# Altium schematic sheet Power_Management.SchDoc: AMC FMC Carrier v4.0.5
size 420 x 297 mm; CompanyName: WUT; Organization: WUT ISE; Address1: Warsaw University of Technology; Address2: Nowowiejska 15/19 00-665 Warsaw; Address3: t.przywozki@gmail.com; Revision: 1; SheetNumber: 10; SheetTotal: 29; Project: AMC FMC Carrier v4.0.5; ModifiedBy: F. Świtakowski; CheckedDate: -; Title2: Power entry & management; DivGrp: ISE; Designer: T. Przywozki; ModifiedDate: -; ProjectName: ADC/DAC MEZZANINE
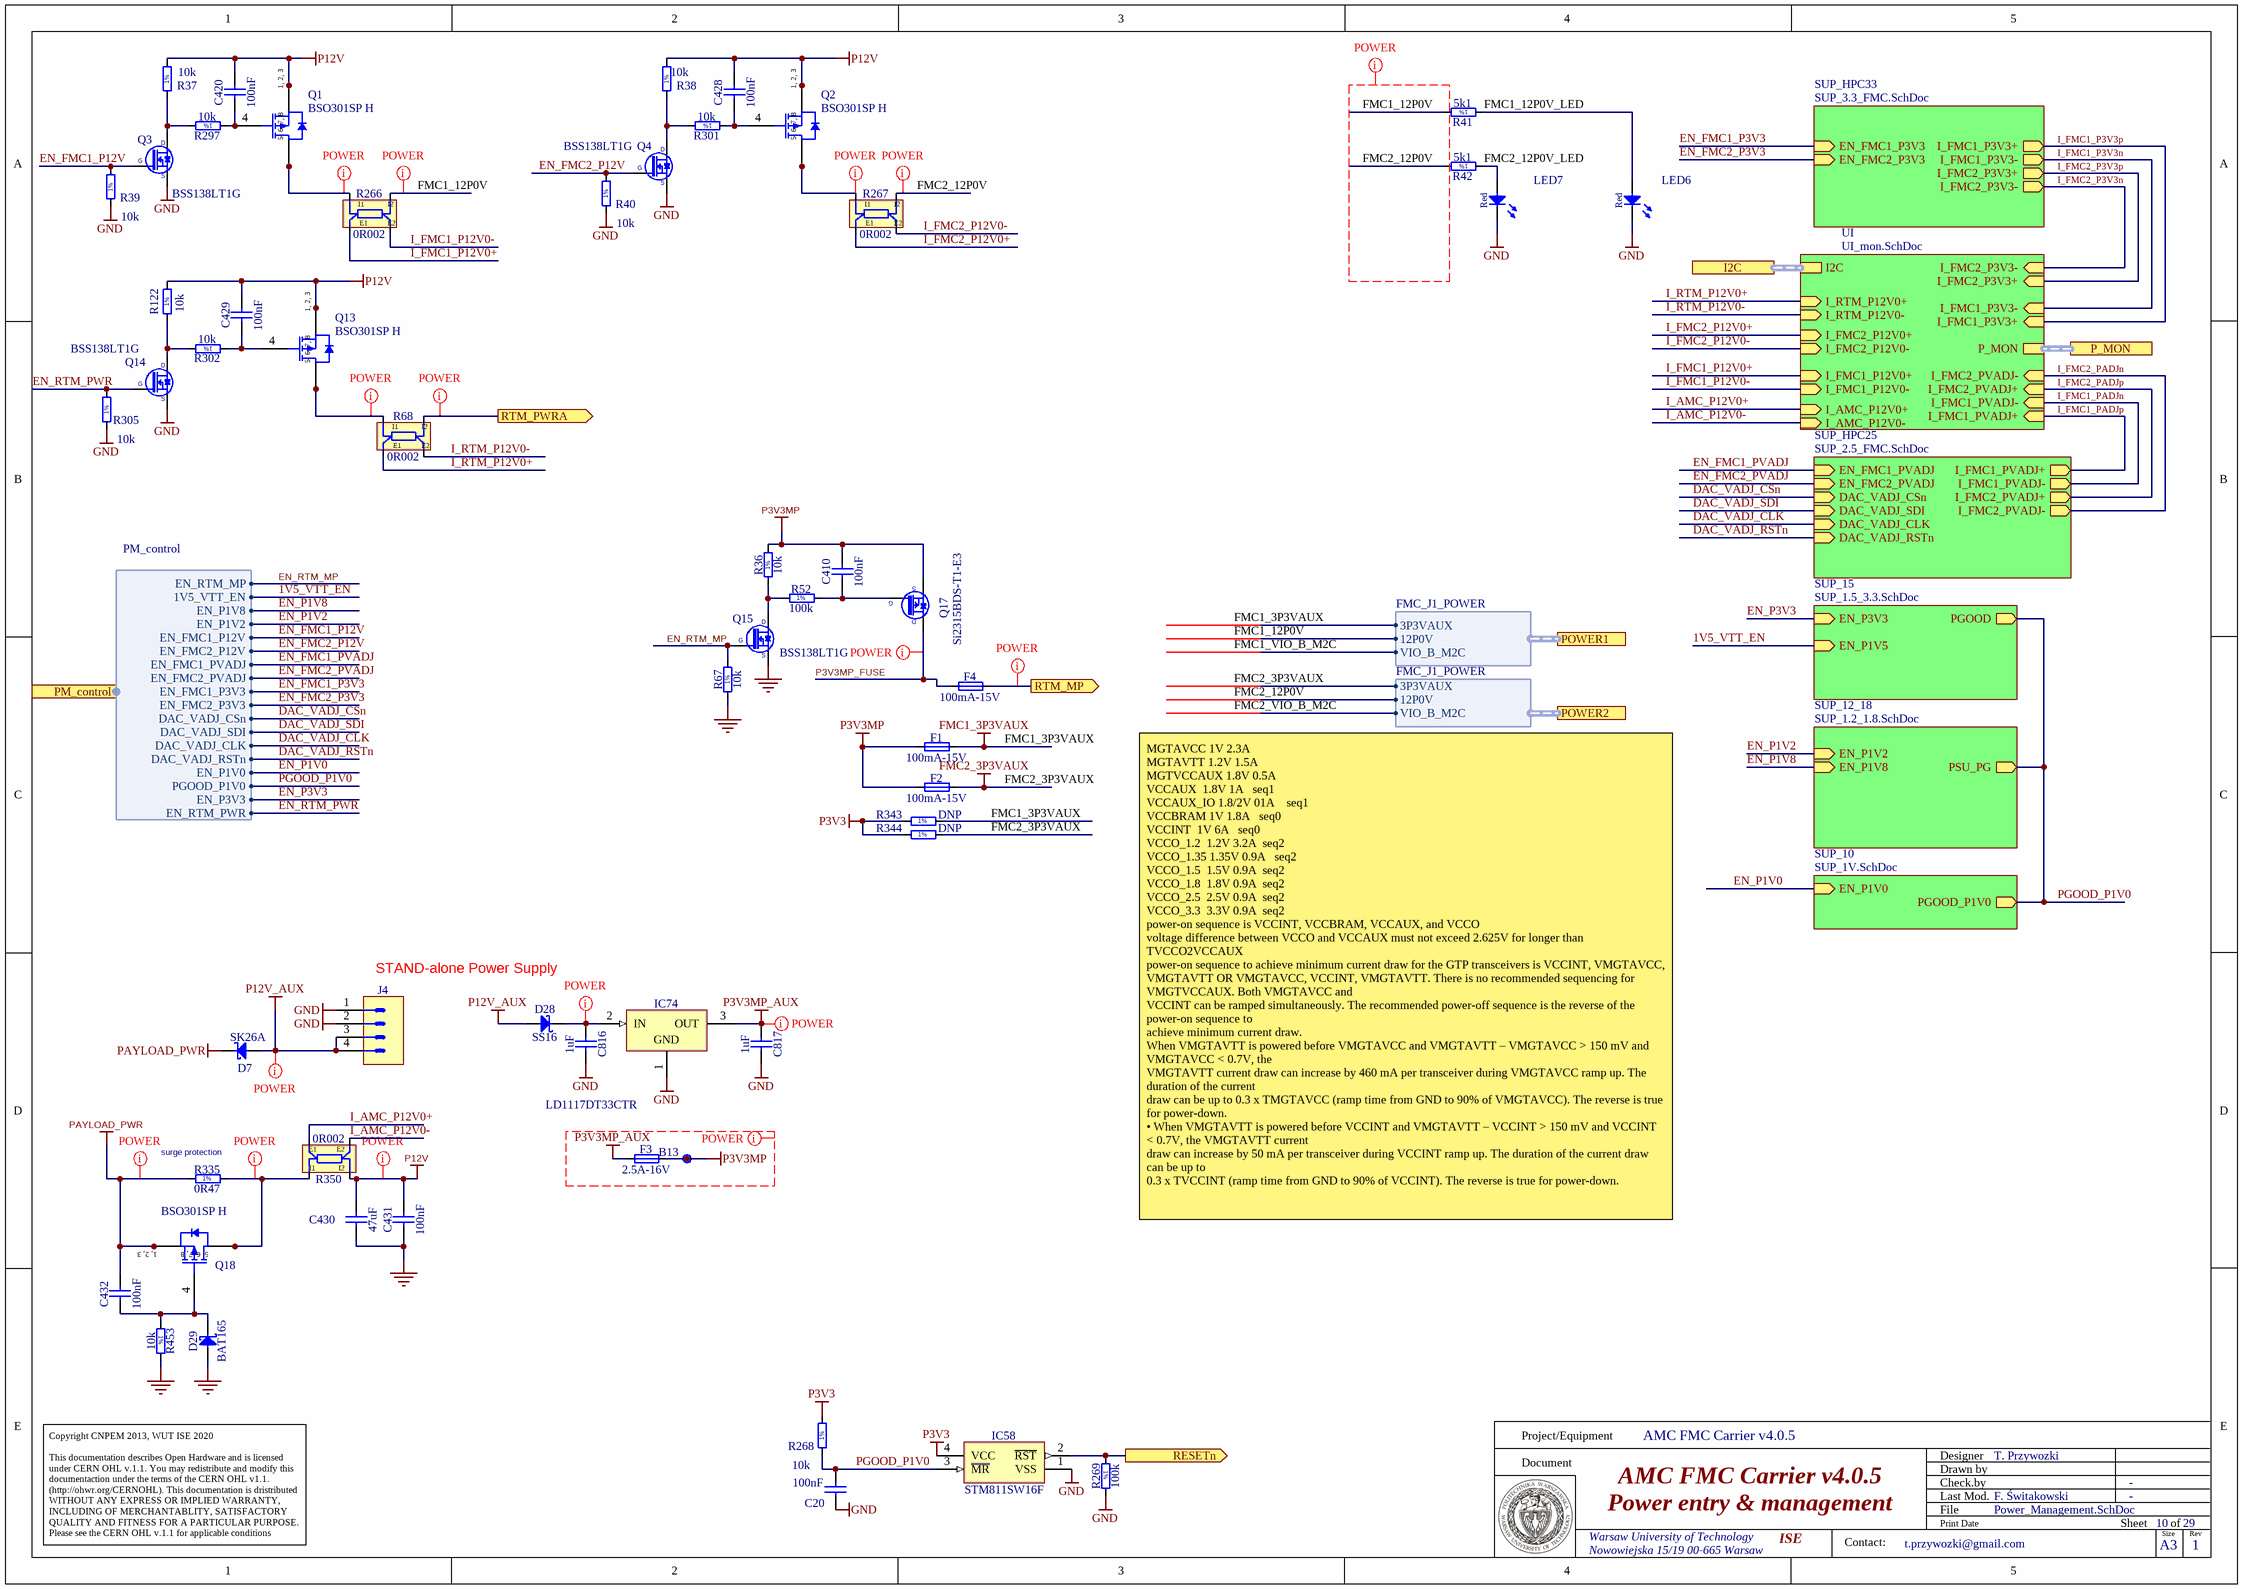
[diagram p0: Power_Management.SchDoc]

## Parts
B13  SMD Pad  [C100]  (value not drawn)
C20  100nF  [CAPC0603X33N]
C410  100nF  [CAPC1005X55N]
C420  100nF  [CAPC1005X55N]
C428  100nF  [CAPC1005X55N]
C429  100nF  [CAPC1005X55N]
C430  47uF  [CAPC3216X180N]
C431  100nF  [CAPC1005X55N]
C432  100nF  [CAPC1005X55N]
C816  1uF  [CAPC1608X87N]
C817  1uF  [CAPC1608X87N]
D7  SK26A  [DIOM5126X265N]
D28  SS16  [DIOM5127X229N]
D29  BAT165  [SOD2512X110N]
F1  100mA-15V  [FUSR_LITTELFUSE_0805L010]
F2  100mA-15V  [FUSR_LITTELFUSE_0805L010]
F3  2.5A-16V  [FUSR_BOURNS_MF-MSMF_STYLE2]
F4  100mA-15V  [FUSR_LITTELFUSE_0805L010]
IC58  STM811SW16F  [SOT143N]
IC74  LD1117DT33CTR  [TO228P972X240-3N-R540X510]
J4  Mini-Fit Jr.™  [MOLEX_39-28-1043]  (value not drawn)
LED6  Red  [LED_KINGBRIGHT_KPH-1608SURCK]
LED7  Red  [LED_KINGBRIGHT_KPH-1608SURCK]
Q1  BSO301SP H  [INF-P-DSO-8-3_L]
Q2  BSO301SP H  [INF-P-DSO-8-3_L]
Q3  BSS138LT1G  [SOT95P240X110-3N]
Q4  BSS138LT1G  [SOT95P240X110-3N]
Q13  BSO301SP H  [INF-P-DSO-8-3_L]
Q14  BSS138LT1G  [SOT95P240X110-3N]
Q15  BSS138LT1G  [SOT95P240X110-3N]
Q17  Si2315BDS-T1-E3  [SOT95P237X112-3N]
Q18  BSO301SP H  [INF-P-DSO-8-3_L]
R36  10k  [RESC1005X40N]
R37  10k  [RESC1005X40N]
R38  10k  [RESC1005X40N]
R39  10k  [RESC1005X40N]
R40  10k  [RESC1005X40N]
R41  5k1  [RESC1608X55N]
R42  5k1  [RESC1608X55N]
R52  100k  [RESC1005X40N]
R67  10k  [RESC1005X40N]
R68  0R002  [RES_VISHAY_WSK2512_0R005-0R2]
R122  10k  [RESC1005X40N]
R266  0R002  [RES_VISHAY_WSK2512_0R005-0R2]
R267  0R002  [RES_VISHAY_WSK2512_0R005-0R2]
R268  10k  [RESC1005X40N]
R269  100k  [RESC1005X40N]
R297  10k  [RESC1005X40N]
R301  10k  [RESC1005X40N]
R302  10k  [RESC1005X40N]
R305  10k  [RESC1005X40N]
R335  0R47  [RESC3216X65N]
R343  DNP  [RESC1005X40N]
R344  DNP  [RESC1005X40N]
R350  0R002  [RES_VISHAY_WSK2512_0R005-0R2]
R453  10k  [RESC1005X40N]

## Sub-sheets
SUP_10 = SUP_1V.SchDoc: PGOOD_P1V0 (out), EN_P1V0 (in)
SUP_12_18 = SUP_1.2_1.8.SchDoc: EN_P1V2 (in), EN_P1V8 (in), PSU_PG (out)
SUP_15 = SUP_1.5_3.3.SchDoc: PGOOD (out), EN_P1V5 (in), EN_P3V3 (in)
SUP_HPC25 = SUP_2.5_FMC.SchDoc: EN_FMC1_PVADJ (in), EN_FMC2_PVADJ (in), I_FMC1_PVADJ+ (out), I_FMC1_PVADJ- (out), I_FMC2_PVADJ+ (out), I_FMC2_PVADJ- (out), DAC_VADJ_CSn (in), DAC_VADJ_SDI (in), DAC_VADJ_CLK (in), DAC_VADJ_RSTn (in)
SUP_HPC33 = SUP_3.3_FMC.SchDoc: EN_FMC1_P3V3 (in), EN_FMC2_P3V3 (in), I_FMC1_P3V3+ (out), I_FMC1_P3V3- (out), I_FMC2_P3V3+ (out), I_FMC2_P3V3- (out)
UI = UI_mon.SchDoc: I_FMC2_P3V3- (in), I_FMC2_P3V3+ (in), I_FMC1_P3V3- (in), I_FMC1_P3V3+ (in), I_FMC1_PVADJ+ (in), I_FMC1_PVADJ- (in), I_FMC2_PVADJ+ (in), I_FMC2_PVADJ- (in), I_FMC2_P12V0+ (in), I_FMC2_P12V0- (in), I_FMC1_P12V0+ (in), I_FMC1_P12V0- (in), I2C (harness I2C), I_RTM_P12V0+ (in), I_RTM_P12V0- (in), P_MON (harness P_MON), I_AMC_P12V0+ (in), I_AMC_P12V0- (in)

## Ports
I2C (harness I2C), P_MON (harness P_MON), PM_control (harness PM_control), POWER1 (harness FMC_J1_POWER), POWER2 (harness FMC_J1_POWER), RESETn (out), RTM_MP (out), RTM_PWRA (out)

## Harnesses
FMC_J1_POWER: 3P3VAUX, 12P0V, VIO_B_M2C
PM_control: EN_P1V8, EN_P1V2, EN_FMC1_P12V, EN_FMC2_P12V, EN_FMC1_PVADJ, EN_FMC2_PVADJ, EN_FMC1_P3V3, EN_FMC2_P3V3, DAC_VADJ_CSn, DAC_VADJ_SDI, DAC_VADJ_CLK, DAC_VADJ_RSTn, 1V5_VTT_EN, EN_P1V0, PGOOD_P1V0, EN_P3V3, EN_RTM_PWR, EN_RTM_MP

## Nets
FMC1_3P3VAUX: F1.2 R343.2 ; port POWER1.3P3VAUX
FMC2_3P3VAUX: F2.2 R344.2 ; port POWER2.3P3VAUX
GND: C20.2 C430.1 C431.1 C816.2 C817.2 D29.2(A) IC58.1(VSS) IC74.1(GND) J4.1 J4.2 LED6.1(C) LED7.1(C) Q3.2(S) Q4.2(S) Q14.2(S) Q15.2(S) R39.1 R40.1 R67.1 R269.2 R305.1 R453.2
P3V3: IC58.4(VCC) R268.2 R343.1 R344.1
P3V3MP: B13.1 C410.2 F1.1 F2.1 F3.1 Q17.2(S) R36.2
P3V3MP_AUX: C817.1 F3.2 IC74.3(OUT)
P12V: C420.2 C428.2 C429.2 C430.2 C431.2 Q1.1(SOURCE) Q1.2(SOURCE) Q1.3(SOURCE) Q2.1(SOURCE) Q2.2(SOURCE) Q2.3(SOURCE) Q13.1(SOURCE) Q13.2(SOURCE) Q13.3(SOURCE) R37.2 R38.2 R122.2 R350.I2
P12V_AUX: D7.2(A) D28.2(A) J4.3 J4.4
PAYLOAD_PWR: C432.2 D7.1(C) Q18.1(SOURCE) Q18.2(SOURCE) Q18.3(SOURCE) R335.1
1V5_VTT_EN: sheet SUP_15/EN_P1V5, port PM_control.1V5_VTT_EN
DAC_VADJ_CLK: sheet SUP_HPC25/DAC_VADJ_CLK, port PM_control.DAC_VADJ_CLK
DAC_VADJ_CSn: sheet SUP_HPC25/DAC_VADJ_CSn, port PM_control.DAC_VADJ_CSn
DAC_VADJ_RSTn: sheet SUP_HPC25/DAC_VADJ_RSTn, port PM_control.DAC_VADJ_RSTn
DAC_VADJ_SDI: sheet SUP_HPC25/DAC_VADJ_SDI, port PM_control.DAC_VADJ_SDI
EN_FMC1_P3V3: sheet SUP_HPC33/EN_FMC1_P3V3, port PM_control.EN_FMC1_P3V3
EN_FMC1_P12V: Q3.1(G) R39.2 ; port PM_control.EN_FMC1_P12V
EN_FMC1_PVADJ: sheet SUP_HPC25/EN_FMC1_PVADJ, port PM_control.EN_FMC1_PVADJ
EN_FMC2_P3V3: sheet SUP_HPC33/EN_FMC2_P3V3, port PM_control.EN_FMC2_P3V3
EN_FMC2_P12V: Q4.1(G) R40.2 ; port PM_control.EN_FMC2_P12V
EN_FMC2_PVADJ: sheet SUP_HPC25/EN_FMC2_PVADJ, port PM_control.EN_FMC2_PVADJ
EN_P1V0: sheet SUP_10/EN_P1V0, port PM_control.EN_P1V0
EN_P1V2: sheet SUP_12_18/EN_P1V2, port PM_control.EN_P1V2
EN_P1V8: sheet SUP_12_18/EN_P1V8, port PM_control.EN_P1V8
EN_P3V3: sheet SUP_15/EN_P3V3, port PM_control.EN_P3V3
EN_RTM_MP: Q15.1(G) R67.2 ; port PM_control.EN_RTM_MP
EN_RTM_PWR: Q14.1(G) R305.2 ; port PM_control.EN_RTM_PWR
FMC1_12P0V: R41.2 R266.I2 ; port POWER1.12P0V
FMC1_12P0V_LED: LED6.2(A) R41.1
FMC1_VIO_B_M2C: port POWER1.VIO_B_M2C
FMC2_12P0V: R42.2 R267.I2 ; port POWER2.12P0V
FMC2_12P0V_LED: LED7.2(A) R42.1
FMC2_VIO_B_M2C: port POWER2.VIO_B_M2C
I_AMC_P12V0+: R350.E1 ; sheet UI/I_AMC_P12V0+
I_AMC_P12V0-: R350.E2 ; sheet UI/I_AMC_P12V0-
I_FMC1_P3V3n: sheet SUP_HPC33/I_FMC1_P3V3-, sheet UI/I_FMC1_P3V3-
I_FMC1_P3V3p: sheet SUP_HPC33/I_FMC1_P3V3+, sheet UI/I_FMC1_P3V3+
I_FMC1_P12V0+: R266.E1 ; sheet UI/I_FMC1_P12V0+
I_FMC1_P12V0-: R266.E2 ; sheet UI/I_FMC1_P12V0-
I_FMC1_PADJn: sheet SUP_HPC25/I_FMC1_PVADJ-, sheet UI/I_FMC1_PVADJ-
I_FMC1_PADJp: sheet SUP_HPC25/I_FMC1_PVADJ+, sheet UI/I_FMC1_PVADJ+
I_FMC2_P3V3n: sheet SUP_HPC33/I_FMC2_P3V3-, sheet UI/I_FMC2_P3V3-
I_FMC2_P3V3p: sheet SUP_HPC33/I_FMC2_P3V3+, sheet UI/I_FMC2_P3V3+
I_FMC2_P12V0+: R267.E1 ; sheet UI/I_FMC2_P12V0+
I_FMC2_P12V0-: R267.E2 ; sheet UI/I_FMC2_P12V0-
I_FMC2_PADJn: sheet SUP_HPC25/I_FMC2_PVADJ-, sheet UI/I_FMC2_PVADJ-
I_FMC2_PADJp: sheet SUP_HPC25/I_FMC2_PVADJ+, sheet UI/I_FMC2_PVADJ+
I_RTM_P12V0+: R68.E1 ; sheet UI/I_RTM_P12V0+
I_RTM_P12V0-: R68.E2 ; sheet UI/I_RTM_P12V0-
P3V3MP_FUSE: F4.1 Q17.3(D)
PGOOD_P1V0: C20.1 IC58.3(~{MR}) R268.1 ; sheet SUP_15/PGOOD, sheet SUP_12_18/PSU_PG, sheet SUP_10/PGOOD_P1V0, port PM_control.PGOOD_P1V0
RESETn: IC58.2(~{RST}) R269.1 ; port RESETn
RTM_MP: F4.2 ; port RTM_MP
RTM_PWRA: R68.I2 ; port RTM_PWRA
NetC410_1: C410.1 Q17.1(G) R52.1
NetC420_1: C420.1 Q1.4(GATE) R297.1
NetC428_1: C428.1 Q2.4(GATE) R301.1
NetC429_1: C429.1 Q13.4(GATE) R302.1
NetC432_1: C432.1 D29.1(C) Q18.4(GATE) R453.1
NetC816_1: C816.1 D28.1(C) IC74.2(IN)
NetQ1_5: Q1.5(DRAIN) Q1.6(DRAIN) Q1.7(DRAIN) Q1.8(DRAIN) R266.I1
NetQ2_5: Q2.5(DRAIN) Q2.6(DRAIN) Q2.7(DRAIN) Q2.8(DRAIN) R267.I1
NetQ3_3: Q3.3(D) R37.1 R297.2
NetQ4_3: Q4.3(D) R38.1 R301.2
NetQ13_5: Q13.5(DRAIN) Q13.6(DRAIN) Q13.7(DRAIN) Q13.8(DRAIN) R68.I1
NetQ14_3: Q14.3(D) R122.1 R302.2
NetQ15_3: Q15.3(D) R36.1 R52.2
NetQ18_5: Q18.5(DRAIN) Q18.6(DRAIN) Q18.7(DRAIN) Q18.8(DRAIN) R335.2 R350.I1

## Buses and harness runs
harness port I2C = sheet UI/I2C
harness port P_MON = sheet UI/P_MON

## Layout directives
net class POWER: FMC1_12P0V, FMC2_12P0V, NetC816_1, NetQ1_5, NetQ2_5, NetQ13_5, NetQ18_5, P3V3MP, P3V3MP_AUX, P3V3MP_FUSE, P12V, P12V_AUX, PAYLOAD_PWR, RTM_MP, RTM_PWRA

## Notes on the sheet
- STAND-alone Power Supply
- (near R335) surge protection
- MGTAVCC	1V	2.3A
  MGTAVTT	1.2V	1.5A
  MGTVCCAUX	1.8V	0.5A
  VCCAUX		1.8V	1A			seq1
  VCCAUX_IO	1.8/2V	01A 			seq1
  VCCBRAM	1V	1.8A			seq0
  VCCINT		1V	6A			seq0
  VCCO_1.2		1.2V	3.2A		seq2
  VCCO_1.35	1.35V	0.9A			seq2
  VCCO_1.5		1.5V	0.9A		seq2
  VCCO_1.8		1.8V	0.9A		seq2
  VCCO_2.5		2.5V	0.9A		seq2
  VCCO_3.3		3.3V	0.9A		seq2
  power-on sequence is VCCINT, VCCBRAM, VCCAUX, and VCCO
  voltage difference between VCCO and VCCAUX must not exceed 2.625V for longer than TVCCO2VCCAUX
  power-on sequence to achieve minimum current draw for the GTP transceivers is VCCINT, VMGTAVCC,
  VMGTAVTT OR VMGTAVCC, VCCINT, VMGTAVTT. There is no recommended sequencing for VMGTVCCAUX. Both VMGTAVCC and
  VCCINT can be ramped simultaneously. The recommended power-off sequence is the reverse of the power-on sequence to
  achieve minimum current draw.
  When VMGTAVTT is powered before VMGTAVCC and VMGTAVTT – VMGTAVCC > 150 mV and VMGTAVCC < 0.7V, the
  VMGTAVTT current draw can increase by 460 mA per transceiver during VMGTAVCC ramp up. The duration of the current
  draw can be up to 0.3 x TMGTAVCC (ramp time from GND to 90% of VMGTAVCC). The reverse is true for power-down.
  • When VMGTAVTT is powered before VCCINT and VMGTAVTT – VCCINT > 150 mV and VCCINT < 0.7V, the VMGTAVTT current
  draw can increase by 50 mA per transceiver during VCCINT ramp up. The duration of the current draw can be up to
  0.3 x TVCCINT (ramp time from GND to 90% of VCCINT). The reverse is true for power-down.
- Project/Equipment
- Document
- Designer
- Drawn by
- Check.by
- Copyright CNPEM 2013, WUT ISE 2020
  This documentation describes Open Hardware and is licensed under CERN OHL v.1.1. You may redistribute and modify this documentaction under the terms of the CERN OHL v1.1.
  (http://ohwr.org/CERNOHL). This documentation is dristributed WITHOUT ANY EXPRESS OR IMPLIED WARRANTY, INCLUDING OF MERCHANTABLITY, SATISFACTORY QUALITY AND FITNESS FOR A PARTICULAR PURPOSE. Please see the CERN OHL v.1.1 for applicable conditions
- File
- Last Mod.
- Print Date
- Sheet
- Size
- A3
- of
- Rev
- Contact:
- (in symbol CMP-1099-00003-1) 1, 2, 3; 5, 6, 7, 8
- (in symbol R0402_0R_JUMPER) 1%
- (in symbol R0402_10K_1%_0.0625W_100PPM) 1%
- (in symbol R0402_100K_1%_0.0625W_100PPM) 1%
- (in symbol R0603_5K1_1%_0.1W_100PPM) 1%
- (in symbol R1206_0R47_1%_0.5W_600PPM) 1%

## Library data of the parts
B13 = SMD_PAD_D1MM: Through Hole Pad; Part Description: 1mm Diameter SMD Pad; Mounted: No; Part Number: SMD_PAD_D1MM; Component Kind: Standard (No BOM); Component Type: Standard (No BOM); Pin Count: 1; Family: SMD Pad; Socket: No; SMD: No; Sense: No; Status: None; ComponentHeight: 0mm; HelpURL: Undefined; Author: CERN DEM JLC; CreateDate: 10.10.2017; LatestRevisionDate: 10.10.2017; PackageDescription: 1mm Diameter SMD Pad
C20 = CC0201_100NF_6.3V_10%_X5R: Non-polarised capacitor; Part Description: SMD Multilayer Chip Ceramic Capacitor; Manufacturer: GENERIC; Manufacturer1 Part Number: 02016D104KAT2A; Voltage: 6.3V; TC: X5R; Tolerance: ±10%; Table: Capacitors SMD; Part Number: CC0201_100NF_6.3V_10%_X5R; Component Kind: Standard; Component Type: Standard; Pin Count: 2; Value: 100nF; Status: Not Recommended; Manufacturer Part Number: CC0201_100NF_6.3V_10%_X5R; Case: 0201; Mounted: Yes; Socket: No; SMD: Yes; Manufacturer1 Example: AVX; Manufacturer1 ComponentHeight: 0.33mm; HelpURL: \\cern.ch\dfs\Applications\Altium\Datasheets\CC0201_X5R_AVX.pdf; Author: CERN DEM JLC; CreateDate: 2007-12-03; LatestRevisionDate: 2007-12-03
C410 C420 C428 C429 C431 C432 = CC0402_100NF_16V_10%_X5R: Non-polarised capacitor; Manufacturer: GENERIC; Part Description: SMD Multilayer Chip Ceramic Capacitor; Manufacturer1 Part Number: GRM155R61C104KA88D; Tolerance: ±10%; Voltage: 16V; TC: X5R; Manufacturer Part Number: CC0402_100NF_16V_10%_X5R; Part Number: CC0402_100NF_16V_10%_X5R; Value: 100nF; Component Kind: Standard; Component Type: Standard; Pin Count: 2; Status: None; Case: 0402; Mounted: Yes; Socket: No; SMD: Yes; Sense: No; Manufacturer1 Example: MURATA; Manufacturer1 ComponentHeight: 0.55mm; HelpURL: \\cern.ch\dfs\Applications\Altium\Datasheets\CC0402_X5R_MURATA_GRM.pdf; Author: CERN DEM JLC; CreateDate: 10.12.2013; LatestRevisionDate: 10.12.2013
C430 = CC1206_47UF_25V_20%_X5R: Non-polarised capacitor; Manufacturer: GENERIC; Part Description: SMD Multilayer Chip Ceramic Capacitor; Manufacturer1 Part Number: C3216X5R1E476M160AC; Tolerance: ±20%; Voltage: 25V; TC: X5R; Manufacturer Part Number: CC1206_47UF_25V_20%_X5R; Part Number: CC1206_47UF_25V_20%_X5R; Value: 47uF; Component Kind: Standard; Component Type: Standard; Pin Count: 2; Status: None; Case: 1206; Mounted: Yes; Socket: No; SMD: Yes; Sense: No; Manufacturer1 Example: TDK; Manufacturer1 ComponentHeight: 1.8mm; HelpURL: \\cern.ch\dfs\Applications\Altium\Datasheets\CC1206_X5R_TDK_C.pdf; Author: CERN DEM JLC; CreateDate: 20.11.2013; LatestRevisionDate: 14.03.2017
C816 C817 = CC0603_1UF_16V_10%_X7R: Non-polarised capacitor; Part Description: SMD Multilayer Chip Ceramic Capacitor; Manufacturer: GENERIC; Manufacturer1 Part Number: 223824613663; Voltage: 16V; TC: X7R; Tolerance: ±10%; Table: Capacitors SMD; Part Number: CC0603_1UF_16V_10%_X7R; Component Kind: Standard; Component Type: Standard; Pin Count: 2; Value: 1uF; Status: Preferred; Manufacturer Part Number: CC0603_1uF_16V_10%_X7R; Case: 0603; Mounted: Yes; Socket: No; SMD: Yes; Manufacturer1 Example: PHYCOMP; Manufacturer1 ComponentHeight: 0.87mm; HelpURL: \\cern.ch\dfs\Applications\Altium\Datasheets\CC0805_X5R_PHYCOMP_HC.pdf; Author: CERN DEM JLC; CreateDate: 2007-12-03; LatestRevisionDate: 2007-12-03
D7 = SK26A: Schottky Diode; Part Description: 2A, 60V Surface Mount Schottky Barrier Rectifier; Manufacturer: TAIWAN SEMICONDUCTOR; Voltage: 60V; Power: 2A; PressFit: No; Bonding: No; Part Number: SK26A; Component Kind: Standard; Component Type: Standard; Device: SK26A; PackageDescription: DO-214-AC/SMA Molded Diode, 2-Leads, Body 5.1x2.6mm, IPC Medium Density; Manufacturer Part Number: SK26A; Pin Count: 2; Case: DO-214AC; Mounted: Yes; Socket: No; SMD: Yes; Sense: No; ComponentHeight: 2.5mm; HelpURL: \\cern.ch\dfs\Applications\Altium\Datasheets\SK26A.pdf; Author: CERN DEM JMW; CreateDate: 07.08.2015; LatestRevisionDate: 07.08.2015
D28 = SS16: Schottky Diode; Manufacturer: VISHAY GENERAL SEMICONDUCTOR; Part Description: Surface Mount Schottky Barrier Rectifier; Voltage: 60V; Power: 1A; PressFit: No; Bonding: No; Manufacturer Part Number: SS16; PackageDescription: DO-214-AC Molded Diode, Body 5.1x2.7mm, IPC Medium Density; Part Number: SS16; Component Kind: Standard; Component Type: Standard; Device: SS16; Pin Count: 2; Case: DO-214AC; Mounted: Yes; Socket: No; SMD: Yes; Sense: No; ComponentHeight: 2.29mm; HelpURL: \\cern.ch\dfs\Applications\Altium\Datasheets\SS16.pdf; Author: CERN DEM JLC; CreateDate: 15.07.2008; LatestRevisionDate: 23.08.2010
D29 = BAT165: Schottky Diode; Manufacturer: INFINEON; Part Description: Medium Power AF Schottky Diode; Voltage: 40V; Power: 750mA; PressFit: No; Bonding: No; Manufacturer Part Number: BAT165; PackageDescription: Small Outline Diode (SOD-323), 1.70mm W X 1.25mm L X 1.10mm H body,  IPC Medium Density; Part Number: BAT165; Component Kind: Standard; Component Type: Standard; Device: BAT165; Pin Count: 2; Case: SOD323; Mounted: Yes; Socket: No; SMD: Yes; Sense: No; ComponentHeight: 1.1mm; HelpURL: \\cern.ch\dfs\Applications\Altium\Datasheets\BAT165.pdf; Author: CERN DEM JLC; CreateDate: 12.11.2014; LatestRevisionDate: 12.11.2014
F1 F2 F4 = FUSR_LITTELFUSE_0805L010YR: Fuse; Part Description: POLYFUSE® Surface Mount Resettable PTC; PressFit: No; Manufacturer Part Number: 0805L010YR; Manufacturer: LITTELFUSE; PackageDescription: Surface Mount POLY-FUSE® Resettable PTC, 0805L Series; Part Number: FUSR_LITTELFUSE_0805L010YR; Value: 100mA-15V; Component Kind: Standard; Component Type: Standard; Pin Count: 2; Family: Fuses Resettable; Mounted: Yes; Socket: No; SMD: Yes; Sense: No; ComponentHeight: 1mm; HelpURL: \\cern.ch\dfs\Applications\Altium\Datasheets\FUSR_LITTELFUSE_0805L010YR.pdf; Author: CERN DEM JLC; CreateDate: 11.09.2012; LatestRevisionDate: 11.09.2012
F3 = FUSR_BOURNS_MF-MSMF250/16X-2: Fuse; Part Description: PTC Resettable Fuse; Manufacturer: BOURNS; PressFit: No; Part Number: FUSR_BOURNS_MF-MSMF250/16X-2; Component Kind: Standard; Component Type: Standard; Pin Count: 2; PackageDescription: PTC Resettable Fuse, MF-MSMS Series, Case Style 2; Family: Fuses Resettable; Mounted: Yes; Socket: No; SMD: Yes; Sense: No; Value: 2.5A-16V; Manufacturer Part Number: MF-MSMF250/16X-2; ComponentHeight: 1.6mm; HelpURL: \\cern.ch\dfs\Applications\Altium\Datasheets\FUSR_BOURNS_MF-MSMF.pdf; Author: CERN DEM JLC; CreateDate: 02.03.2011; LatestRevisionDate: 02.03.2011
IC58 = STM811SW16F: Microprocessor Reset Circuit; Part Description: 2.93V Reset Threshold Voltage Microprocessor Reset Circuit; Manufacturer: ST MICROELECTRONICS; PressFit: No; Bonding: No; Part Number: STM811SW16F; Component Kind: Standard; Component Type: Standard; Device: STM811SW16F; PackageDescription: SOT143, 4-Leads, Body 3.0x2.6mm (max), Pitch 1.92mm, IPC Medium Density; Manufacturer Part Number: STM811SW16F; Pin Count: 4; Case: SOT143; Mounted: Yes; Socket: No; SMD: Yes; Sense: No; ComponentHeight: 1.12mm; Author: CERN DEM JLC; HelpURL: \\cern.ch\dfs\Applications\Altium\Datasheets\STM811SW16F.pdf; CreateDate: 17.11.2016; LatestRevisionDate: 17.11.2016
IC74 = LD1117DT33CTR: 3-Terminal Regulator 1=GND 2=IN 3=OUT; Part Description: 3.3V 800mA Low drop fixed and adjustable positive voltage regulators; Manufacturer: ST MICROELECTRONICS; Table: Regulators; Part Number: LD1117DT33CTR; Component Kind: Standard; Component Type: Standard; Device: LD1117DT33CTR; PackageDescription: DPAK TO-252, 2.28mm pitch; 2 pin, 9.725mm L X 6.10mm W X 2.40mm H body, IPC Medium Density; Manufacturer Part Number: LD1117DT33CTR; Pin Count: 3; Case: DPAK; Mounted: Yes; Socket: No; SMD: Yes; ComponentHeight: 2.4mm; HelpURL: \\cern.ch\dfs\Applications\Altium\Datasheets\LD1117DT33CTR.pdf; Author: CERN DEM JLC; CreateDate: 2011-06-08; LatestRevisionDate: 2011-06-08
J4 = MOLEX_39-28-1043: Connector 4 Male; Part Description: 4.20mm (.165") Pitch Mini-Fit Jr.™ Header, Dual Row, Vertical, without Snap-in Plastic Peg PCB Lock, 4 Circuits; Manufacturer: MOLEX; Part Number: MOLEX_39-28-1043; Component Kind: Standard; Component Type: Standard; Pin Count: 4; Family: Mini-Fit Jr.™; Mounted: Yes; Socket: No; SMD: No; Status: None; Manufacturer Part Number: 39-28-1043; ComponentHeight: 13.1mm; HelpURL: \\cern.ch\dfs\Applications\Altium\Datasheets\MOLEX_39-28-1043.pdf; Author: CERN DEM JLC; CreateDate: 2009-03-12; LatestRevisionDate: 2012-03-06; Table: MOLEX
LED6 LED7 = LED_KINGBRIGHT_KPH-1608SURCK: LED Red 1C 2A; Part Description: SMD Hyper Red LED, Case 1.6mmX0.8mm(0603), 0.65mm Thickness; PressFit: No; Bonding: No; Part Number: LED_KINGBRIGHT_KPH-1608SURCK; Component Kind: Standard; Component Type: Standard; Color: Red; PackageDescription: SMT Hyper Red LED, Case 0603, Body L 1.6 x W 0.8mm H 0.65mm; Manufacturer: KINGBRIGHT; Manufacturer Part Number: KPH-1608SURCK; Pin Count: 2; Mounted: Yes; Socket: No; SMD: Yes; Sense: No; ComponentHeight: 0.65mm; HelpURL: \\cern.ch\dfs\Applications\Altium\Datasheets\LED_KINGBRIGHT_KPH-1608SURCK.pdf; Author: CERN DEM JLC; CreateDate: 03.07.2017; LatestRevisionDate: 03.07.2017
Q1 Q2 Q13 Q18 = CMP-1099-00003-1: P-Channel OptiMOS P Power-Transistor, -30 V VDS, -14.9 A ID, -55 to 150 degC, P-DSO-8-3, Reel, Green; Manufacturer: Infineon; QG: -102Â nC; Green: TRUE; VDS (max): -30Â V; Pto t (max): 2.5Â W; VGS(th) (max): -2Â V; RDS (on) (max) (@4.5V): 12Â mOhm; RDS (on) (max): 8Â mOhm; ID (max): -14.9Â A; Rth: 110Â K/W; IDpuls (max): -60Â A; VGS(th) (min): -1Â V; Packing: Reel; ComponentLink3URL: http://www.infineon.com/cms/packages/SMD_-_Surface_Mounted_Devices/P-PG-DSO/P-PG-DSO-08-03x_-6x_-7x_-8x_-10x_-13x_-15x_-18x_-19x_-20x_-23.html?__locale=en; PackageDescription: 8-Pin Plastic Dual Small Outline Package, 4.9 x 3.9 mm Body, 1.27 mm Pitch; ComponentLink2URL: http://www.infineon.com/dgdl/BSO301SP_Rev1.32.pdf?folderId=db3a304314dca38901154a7313d21a66&fileId=db3a304326c2768b0126d226cd5d68ac; Mounting Technology: Surface Mount; ComponentLink2Description: Datasheet; DatasheetVersion: Rev. 1.32; PackageReference: P-DSO-8-3; ComponentLink1URL: http://www.infineon.com/; ComponentLink1Description: Manufacturer URL; Halogen-free: TRUE; PartNumber: BSO301SP H; ComponentLink3Description: Package Specification
Q3 Q4 Q14 = BSS138LT1G: N-CHANNEL MOSFET WITH DIODE; Part Description: 50V 200mA N-Channel Enhancement Mode Field-Effect Transistor; Manufacturer: ON SEMICONDUCTOR; PressFit: No; Bonding: No; Part Number: BSS138LT1G; Component Kind: Standard; Component Type: Standard; Device: BSS138LT1G; PackageDescription: SOT23 3-Leads, Pitch 0.95mm - Body 1.4x3mm, IPC Medium Density; Manufacturer Part Number: BSS138LT1G; Pin Count: 3; Case: SOT23-3; Mounted: Yes; Socket: No; SMD: Yes; Sense: No; ComponentHeight: 1.11mm; HelpURL: \\cern.ch\dfs\Applications\Altium\Datasheets\BSS138LT1G.pdf; Author: CERN DEM JLC; CreateDate: 23.03.2009; LatestRevisionDate: 23.03.2009
Q15 = BSS138LT1G: N-CHANNEL MOSFET WITH DIODE; Manufacturer: ON SEMICONDUCTOR; Part Description: 50V 200mA N-Channel Enhancement Mode Field-Effect Transistor; PressFit: No; Bonding: No; Manufacturer Part Number: BSS138LT1G; PackageDescription: SOT23 3-Leads, Pitch 0.95mm - Body 1.4x3mm, IPC Medium Density; Part Number: BSS138LT1G; Component Kind: Standard; Component Type: Standard; Device: BSS138LT1G; Pin Count: 3; Case: SOT23-3; Mounted: Yes; Socket: No; SMD: Yes; Sense: No; ComponentHeight: 1.11mm; HelpURL: \\cern.ch\dfs\Applications\Altium\Datasheets\BSS138LT1G.pdf; Author: CERN DEM JLC; CreateDate: 23.03.2009; LatestRevisionDate: 23.03.2009
Q17 = Si2315BDS-T1-E3: P-CHANNEL MOSFET WITH DIODE; Part Description: -12V -3A P-Channel STripFET® II Power MOSFET; Manufacturer: VISHAY SILICONIX; PressFit: No; Bonding: No; Part Number: Si2315BDS-T1-E3; Component Kind: Standard; Component Type: Standard; Device: Si2315BDS-T1-E3; PackageDescription: SOT, 0.95mm, pitch; 3 pin,1.30mm W X 2.92mm L X 1.12mm H body, IPC Medium Density; Manufacturer Part Number: Si2315BDS-T1-E3; Pin Count: 3; Case: SOT23-3; Mounted: Yes; Socket: No; SMD: Yes; Sense: No; ComponentHeight: 1.12mm; HelpURL: \\cern.ch\dfs\Applications\Altium\Datasheets\Si2315BDS-T1-E3.pdf; Author: CERN DEM JLC; CreateDate: 02.05.2011; LatestRevisionDate: 02.05.2011
R36 R67 R297 R301 R302 R453 = R0402_10K_1%_0.0625W_100PPM: Resistor - 1%; Manufacturer: GENERIC; Part Description: General Purpose Thick Film Chip Resistor; Manufacturer1 Part Number: 232270671003L; TC: ±100ppm/°C; PressFit: No; Manufacturer Part Number: R0402_10K_1%_0.0625W_100PPM; Part Number: R0402_10K_1%_0.0625W_100PPM; Tolerance: ±1%; Value: 10k; Component Kind: Standard; Component Type: Standard; Pin Count: 2; Status: Not Recommended; Power: 0.0625W; Case: 0402; Mounted: Yes; Sense: No; Socket: No; SMD: Yes; Manufacturer1 Example: YAGEO PHYCOMP; Manufacturer1 ComponentHeight: 0.4mm; HelpURL: \\cern.ch\dfs\Applications\Altium\Datasheets\R0402_Phycomp_RC0402.pdf; Author: CERN DEM JLC; CreateDate: 03.12.2007; LatestRevisionDate: 17.10.2012
R37-R40 R122 R268 R305 = R0402_10K_1%_0.0625W_100PPM: Resistor - 1%; Part Description: General Purpose Thick Film Chip Resistor; Manufacturer: GENERIC; Manufacturer1 Part Number: 232270671003L; TC: ±100ppm/°C; Table: Resistors SMD; Part Number: R0402_10K_1%_0.0625W_100PPM; Component Kind: Standard; Component Type: Standard; Pin Count: 2; Value: 10k; Status: Not recommended; Power: 0.0625W; Tolerance: ±1%; Manufacturer Part Number: R0402_10K_1%_0.0625W_100PPM; Case: 0402; Mounted: Yes; Socket: No; SMD: Yes; Manufacturer1 Example: YAGEO PHYCOMP; Manufacturer1 ComponentHeight: 0.4mm; HelpURL: \\cern.ch\dfs\Applications\Altium\Datasheets\R0402_Phycomp_RC0402.pdf; Author: CERN DEM JLC; CreateDate: 2007-12-03; LatestRevisionDate: 2012-10-17
R41 R42 = R0603_5K1_1%_0.1W_100PPM: Resistor - 1%; Part Description: General Purpose Thick Film Chip Resistor; Manufacturer: GENERIC; Manufacturer1 Part Number: NRC06F5101TRF; Power: 0.1W; TC: ±100ppm/°C; Table: Resistors SMD; Part Number: R0603_5K1_1%_0.1W_100PPM; Component Kind: Standard; Component Type: Standard; Pin Count: 2; Value: 5k1; Status: Preferred; Tolerance: ±1%; Manufacturer Part Number: R0603_5K1_1%_0.1W_100PPM; Case: 0603; Mounted: Yes; Socket: No; SMD: Yes; Manufacturer1 Example: NIC COMPONENT; Manufacturer1 ComponentHeight: 0.55mm; HelpURL: \\cern.ch\dfs\Applications\Altium\Datasheets\R0603_NIC_NRC.pdf; Author: CERN DEM JLC; CreateDate: 2007-12-03; LatestRevisionDate: 2008-03-13
R52 = R0402_100K_1%_0.0625W_100PPM: Resistor - 1%; Manufacturer: GENERIC; Part Description: General Purpose Thick Film Chip Resistor; Manufacturer1 Part Number: 232270671004L; TC: ±100ppm/°C; PressFit: No; Manufacturer Part Number: R0402_100K_1%_0.0625W_100PPM; Part Number: R0402_100K_1%_0.0625W_100PPM; Tolerance: ±1%; Value: 100k; Component Kind: Standard; Component Type: Standard; Pin Count: 2; Status: Not Recommended; Power: 0.0625W; Case: 0402; Mounted: Yes; Sense: No; Socket: No; SMD: Yes; Manufacturer1 Example: YAGEO PHYCOMP; Manufacturer1 ComponentHeight: 0.4mm; HelpURL: \\cern.ch\dfs\Applications\Altium\Datasheets\R0402_Phycomp_RC0402.pdf; Author: CERN DEM JLC; CreateDate: 2007-12-03; LatestRevisionDate: 2012-10-17
R68 R266 R267 R350 = R2512_0R002_1%_1W_35PPM_VISHAY_WSK: Power and Current Sensing Resistor; Part Description: Power Metal Strip® Resistor, Low Value; Manufacturer: VISHAY DALE; Manufacturer Part Number: WSK25122L000FEA; Power: 1W; TC: ±35ppm/°C; Tolerance: ±1%; PressFit: No; Part Number: R2512_0R002_1%_1W_35PPM_VISHAY_WSK; Component Kind: Standard; Component Type: Standard; Pin Count: 4; Value: 0R002; Status: None; Case: 2512; Mounted: Yes; Sense: No; Socket: No; SMD: Yes; ComponentHeight: 0.89mm; HelpURL: \\cern.ch\dfs\Applications\Altium\Datasheets\R2512_VISHAY_WSK.pdf; Author: CERN DEM MR; CreateDate: 08.11.2016; LatestRevisionDate: 19.02.2018
R269 = R0402_100K_1%_0.0625W_100PPM: Resistor - 1%; Part Description: General Purpose Thick Film Chip Resistor; Manufacturer: GENERIC; Manufacturer1 Part Number: 232270671004L; TC: ±100ppm/°C; Table: Resistors SMD; Part Number: R0402_100K_1%_0.0625W_100PPM; Component Kind: Standard; Component Type: Standard; Pin Count: 2; Value: 100k; Status: Not recommended; Power: 0.0625W; Tolerance: ±1%; Manufacturer Part Number: R0402_100K_1%_0.0625W_100PPM; Case: 0402; Mounted: Yes; Socket: No; SMD: Yes; Manufacturer1 Example: YAGEO PHYCOMP; Manufacturer1 ComponentHeight: 0.4mm; HelpURL: \\cern.ch\dfs\Applications\Altium\Datasheets\R0402_Phycomp_RC0402.pdf; Author: CERN DEM JLC; CreateDate: 2007-12-03; LatestRevisionDate: 2012-10-17
R335 = R1206_0R47_1%_0.5W_600PPM: Resistor - 1%; Manufacturer Part Number: RL1206FR-7W0R47  (35051914707); Manufacturer: YAGEO PHYCOMP; Part Description: Low Ohmique High Power Chip Resistor; Power: 0.5W; TC: ±600ppm/°C; PressFit: No; Part Number: R1206_0R47_1%_0.5W_600PPM; Tolerance: ±1%; Value: 0R47; Component Kind: Standard; Component Type: Standard; Pin Count: 2; Status: Not Recommended; Case: 1206; Mounted: Yes; Sense: No; Socket: No; SMD: Yes; ComponentHeight: 0.65mm; HelpURL: \\cern.ch\dfs\Applications\Altium\Datasheets\R1206_PHYCOMP_LRC02P.pdf; Author: CERN DEM JLC; CreateDate: 22.04.2010; LatestRevisionDate: 22.04.2010
R343 R344 = R0402_0R_JUMPER: Resistor - 1%; Part Description: 1A (0.05R Max DC Resistance) Zero Ohm Jumper; Manufacturer: GENERIC; Manufacturer1 Part Number: 232270591001L; Value: 0; Table: Resistors SMD; Part Number: R0402_0R_JUMPER; Component Kind: Standard; Component Type: Standard; Pin Count: 2; Status: Not recommended; Manufacturer Part Number: R0402_0R_JUMPER; Case: 0402; Mounted: Yes; Socket: No; SMD: Yes; Manufacturer1 Example: YAGEO PHYCOMP; Manufacturer1 ComponentHeight: 0.4mm; HelpURL: \\cern.ch\dfs\Applications\Altium\Datasheets\R0402_Phycomp_RC0402.pdf; Author: CERN DEM JLC; CreateDate: 2007-12-03; LatestRevisionDate: 2012-10-17